# Altium project HVBoard.PrjPcb (part 2 of 2)

## Sheet ConnectorsAndProtection.SchDoc
size A4
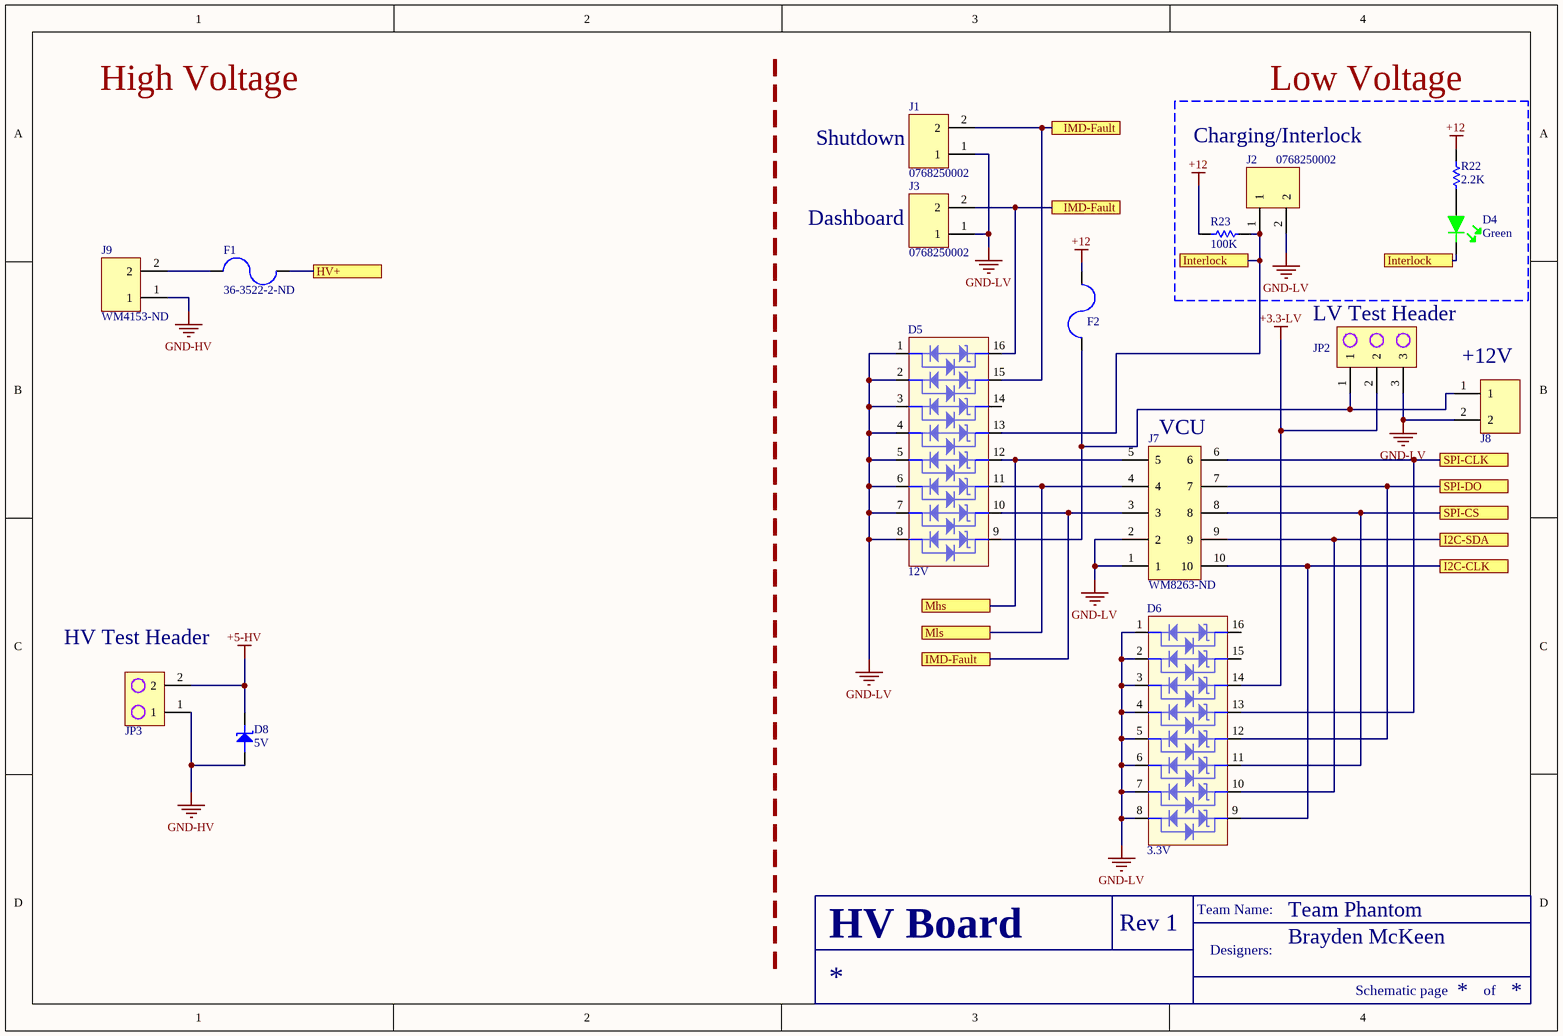
[diagram p3: ConnectorsAndProtection.SchDoc]

### Parts
D4  Green  [LED-0603]
D5  12V  [16-SO]
D6  3.3V  [16-SO]
D8  5V  [DIODE-SOD323]
F1  36-3522-2-ND  [Fuse Holder - 500V - 20A]
F2  36-3555-2-ND  [Fuse Holder - 500V - 50A]  (value not drawn)
J1  0768250002  [2X1PIN]
J2  0768250002  [2X1PIN]
J3  0768250002  [2X1PIN]
J7  WM8263-ND  [2X5PIN]
J8  952-2900-ND  [2Pin-POWER]  (value not drawn)
J9  WM4153-ND  [2PIN]
JP2  732-5316-ND  [3PIN-JP]  (value not drawn)
JP3  732-5315-ND  [2PIN-JP]  (value not drawn)
R22  2.2K  [RES-0805]
R23  100K  [RES-0805]

### Blocks framed on the sheet
Charging/Interlock: D4 J2 R22 R23

### Ports
HV+, I2C-CLK, I2C-SDA, IMD-Fault, Interlock, Mhs, Mls, SPI-CLK, SPI-CS, SPI-DO

### Nets
+3.3-LV: D6.14 JP2.2
+5-HV: D8.1 JP3.2
+12: F2.2 R22.1 R23.1
GND-HV: D8.2 J9.1 JP3.1
GND-LV: D5.1 D5.2 D5.3 D5.4 D5.5 D5.6 D5.7 D5.8 D6.1 D6.2 D6.3 D6.4 D6.5 D6.6 D6.7 D6.8 J1.1 J2.2 J3.1 J7.1 J7.2 J8.2 JP2.3
NetC1_2: F1.2 ; port HV+
NetD4_1: D4.1 R22.2
NetD4_2: D4.2 D5.13 J2.1 R23.2 ; port Interlock
NetD5_9: D5.9 F2.1 J8.1 JP2.1
NetD5_10: D5.10 D5.15 D5.16 J1.2 J3.2 J7.3 ; port IMD-Fault
NetD5_11: D5.11 J7.4 ; port Mls
NetD5_12: D5.12 J7.5 ; port Mhs
NetD6_9: D6.9 J7.10 ; port I2C-CLK
NetD6_10: D6.10 J7.9 ; port I2C-SDA
NetD6_11: D6.11 J7.8 ; port SPI-CS
NetD6_12: D6.12 J7.7 ; port SPI-DO
NetD6_13: D6.13 J7.6 ; port SPI-CLK
NetF1_1: F1.1 J9.2

Not connected (* = marked no-connect by the designer): D5 14; D6 15 16

### Notes on the sheet
- Shutdown
- (near J3) Dashboard
- LV Test Header
- (near J8) +12V
- (near J7) VCU
- (near JP3) HV Test Header
- High Voltage
- Low Voltage
- Team Name:
- Designers:
- Schematic page
- of

### Library data of the parts
D4 = LED-Green: LED GREEN CLEAR 0603 SMD; Manufacturer: Wurth Electronics; Manufacturer Part Number: 150060VS75000; Luminous Intensity: 40mcd; Viewing Angle: 140°; Forward Voltage: 2V; Wavelength: 570nm; Lens Style: Clear,Rectangular; Forward Current: 30mA; Test Current: 20mA; Supplier 1: Digi-Key; Stock 1: 118118; Pricing 1: 1=0.14, 50=0.133, 100=0.114, 500=0.099 (USD); Mount: Surface Mount; Case/Package: 0603; Number of Pins: 2; Color: Green; Case Code (Metric): 1608; Case Code (Imperial): 0603; Min Operating Temperature: -40°C; Max Operating Temperature: 85°C; Package Quantity: 1; Packaging: Tape and Reel; Dominant Wavelength: 570nm; Length: 1.6mm; Height: 0.7mm; Width: 0.8mm; REACH SVHC: Unknown; ComponentLink1URL: https://katalog.we-online.de/led/datasheet/150060VS75000.pdf?src-supplier=Digi-Key; ComponentLink1Description: https://katalog.we-online.de/led/datasheet/150060VS75000.pdf?src-supplier=Digi-Key; Supplier Part Number 1: 732-4980-1-ND
D5 = TVS-12V-X8: PD 300W VWM 12VCJ 25PFPACKAGE SO; Supplier 1: Digi-Key; Supplier Part Number 1: 1655-2159-1-ND
D6 = TVS-3.3V-X8: PD 300W VWM 3.3VCJ 25PFPACKAGE S; Supplier 1: Digi-Key; Supplier Part Number 1: 1655-2157-1-ND
D8 = TVS-5V: TVS DIODE 5V SOD323; Manufacturer: Nexperia; Manufacturer Part Number: PESD5V0U1UA,115; Supplier 1: Digi-Key; Stock 1: 127058; Pricing 1: 1=0.43, 10=0.32, 25=0.28, 100=0.152, 250=0.1512, 500=0.124, 1000=0.092 (USD); ComponentLink1URL: https://assets.nexperia.com/documents/data-sheet/PESD5V0U1UA_UB_UL.pdf?src-supplier=Digi-Key; ComponentLink1Description: https://assets.nexperia.com/documents/data-sheet/PESD5V0U1UA_UB_UL.pdf?src-supplier=Digi-Key; ComponentLink2URL: http://www.farnell.com/datasheets/453996.pdf?src-supplier=Farnell; ComponentLink2Description: http://www.farnell.com/datasheets/453996.pdf?src-supplier=Farnell; Supplier Part Number 1: 1727-4155-6-ND
F1 = Fuse Holder - 500V - 20A: FUSE CLIP BLADE 500V 20A PCB; Supplier 1: Digi-Key
F2 = Fuse Holder - 500V - 50A: FUSE BLOCK BLADE 500V 50A PCB; Supplier 1: Digi-Key
J1-J3 = 2X1PIN: CONN HEADER R/A 2POS; Manufacturer: Molex; Manufacturer Part Number: 76825-0002; Number of Circuits: 2; Gender: Male; Pitch: 5.7mm; Supplier 1: Digi-Key; Stock 1: 0; Pricing 1: 1=1.13, 10=0.993, 25=0.9344, 50=0.8956, 100=0.8567, 250=0.7788, 500=0.70092, 1000=0.62304, 2500=0.56463 (USD); Color: Black; Contact Plating: Tin; Contact Material: Copper; Termination: Through Hole; Number of Rows: 2; Orientation: Right Angle; Number of Contacts: 2; REACH SVHC: Unknown; ComponentLink1URL: http://www.farnell.com/datasheets/1968956.pdf?src-supplier=Element14; ComponentLink1Description: http://www.farnell.com/datasheets/1968956.pdf?src-supplier=Element14; ComponentLink2URL: http://www.farnell.com/datasheets/2216551.pdf?src-supplier=Newark; ComponentLink2Description: http://www.farnell.com/datasheets/2216551.pdf?src-supplier=Newark; ComponentLink3URL: http://www.farnell.com/datasheets/2216551.pdf?src-supplier=Farnell; ComponentLink3Description: http://www.farnell.com/datasheets/2216551.pdf?src-supplier=Farnell; ComponentLink4URL: https://www.molex.com/pdm_docs/sd/768250002_sd.pdf?src-supplier=Digi-Key; ComponentLink4Description: https://www.molex.com/pdm_docs/sd/768250002_sd.pdf?src-supplier=Digi-Key; ComponentLink5URL: http://www.farnell.com/datasheets/2001779.pdf?src-supplier=Element14; ComponentLink5Description: http://www.farnell.com/datasheets/2001779.pdf?src-supplier=Element14; ComponentLink6URL: http://www.alliedelec.com/images/products/datasheets/bm/BrandonData/70717238.pdf?src-supplier=Allied+Electronics; ComponentLink6Description: http://www.alliedelec.com/images/products/datasheets/bm/BrandonData/70717238.pdf?src-supplier=Allied+Electronics; Supplier Part Number 1: WM11969-ND
J7 = 2X5PIN: CONN HEADER R/A 10POS 2.54MM; Manufacturer: Molex; Manufacturer Part Number: 90130-3110; Number of Positions: 10; Connector Type: Male Pin; Max Voltage Rating (DC): 350.35kV; Max Voltage Rating (AC): 350V; Gender: Male; Current Rating: 3A; Row Spacing: 0.1inch; Glow Wire Compliant: Non-compliant; Supplier 1: Digi-Key; Stock 1: 3596; Pricing 1: 1=1.47, 10=1.329, 100=1.1395, 500=0.94956, 1000=0.8139, 5000=0.72166, 10000=0.70538 (USD); Mount: Through Hole; Color: Black; Housing Color: Black; Housing Material: Polyester; Contact Material: Brass; Contact Plating: Tin,Lead; Min Operating Temperature: -55°C; Max Operating Temperature: 125°C; Number of Rows: 2; Packaging: Tray; Termination: Solder; Orientation: Right Angle; Number of Contacts: 10; Package Quantity: 1; Voltage Rating: 350V; Number of Circuits: 10; Voltage Rating (DC): 350V; Length: 15.42mm; Pitch: 2.54mm; Depth: 9.75mm; Contact Mating Length: 0.266inch; Radiation Hardening: No; Flammability Rating: UL94 V-0; REACH SVHC: No SVHC; Lead Free: Lead Free; ComponentLink1URL: http://www.mouser.com/ds/2/276/0901303110_PCB_HEADERS-151522.pdf?src-supplier=Mouser; ComponentLink1Description: http://www.mouser.com/ds/2/276/0901303110_PCB_HEADERS-151522.pdf?src-supplier=Mouser; ComponentLink2URL: http://uk.rs-online.com/webdocs/13c4/0900766b813c4c8e.pdf?src-supplier=RSComponents; ComponentLink2Description: http://uk.rs-online.com/webdocs/13c4/0900766b813c4c8e.pdf?src-supplier=RSComponents; ComponentLink3URL: http://www.molex.com/webdocs/datasheets/pdf/en-us/0901303110_PCB_HEADERS.pdf?src-supplier=Avnet; ComponentLink3Description: http://www.molex.com/webdocs/datasheets/pdf/en-us/0901303110_PCB_HEADERS.pdf?src-supplier=Avnet; ComponentLink4URL: http://www.molex.com/pdm_docs/sd/901303110_sd.pdf?src-supplier=Digi-Key; ComponentLink4Description: http://www.molex.com/pdm_docs/sd/901303110_sd.pdf?src-supplier=Digi-Key; ComponentLink5URL: http://www.molex.com/webdocs/datasheets/pdf/en-us/0901303110_PCB_HEADERS.pdf?src-supplier=Avnet+Europe; ComponentLink5Description: http://www.molex.com/webdocs/datasheets/pdf/en-us/0901303110_PCB_HEADERS.pdf?src-supplier=Avnet+Europe; Supplier Part Number 1: WM8263-ND
J8 = 2PIN-POWER: CONN HEADER VERT 2POS 4MM 800V 40A; Supplier 1: Digi-Key; Supplier Part Number 1: 952-2900-ND
J9 = 2PIN: CONN HEADER R/A 2POS 2.54MM; Manufacturer: Molex; Manufacturer Part Number: 0705530106; Number of Positions: 2; Contact Resistance: 30mR; Connector Type: Male Pin; Supplier 1: Digi-Key; Stock 1: 2224; Pricing 1: 1=1.38, 10=1.25, 100=1.071, 500=0.8925, 1000=0.765, 5000=0.6783, 10000=0.663 (USD); Mount: Through Hole; Housing Material: Polyester; Contact Plating: Gold; Contact Material: Bronze; Color: Black; Housing Color: Black; Min Operating Temperature: -40°C; Max Operating Temperature: 105°C; Number of Rows: 1; Packaging: Rail/Tube; Termination: Solder; Number of Contacts: 2; Orientation: Right Angle; Length: 7.37mm; Pitch: 2.54mm; Depth: 13.59mm; Contact Mating Length: 0.24inch; ComponentLink1URL: http://www.molex.com/webdocs/datasheets/pdf/en-us/0705530106_PCB_HEADERS.pdf?src-supplier=Avnet+Asia; ComponentLink1Description: http://www.molex.com/webdocs/datasheets/pdf/en-us/0705530106_PCB_HEADERS.pdf?src-supplier=Avnet+Asia; ComponentLink2URL: https://www.molex.com/pdm_docs/ps/PS-70400.pdf?src-supplier=Digi-Key; ComponentLink2Description: https://www.molex.com/pdm_docs/ps/PS-70400.pdf?src-supplier=Digi-Key; Supplier Part Number 1: WM4153-ND
JP2 = 3PIN-TEST: CONN HEADER VERT 3POS 2.54MM
JP3 = 2PIN-TEST: CONN HEADER VERT 2POS 2.54MM
R22 = 0805-2.2KR: RES SMD 2.2K OHM 1% 1/8W 0805; Manufacturer: Yageo; Manufacturer Part Number: RC0805FR-072K2L; Power Rating: 125mW; Resistance: 2.2kR; Temperature Coefficient: 100ppm/°C; Voltage Rating: 150V; Supplier 1: Digi-Key; Stock 1: 4156138; Pricing 1: 1=0.1, 10=0.04, 100=0.0163, 1000=0.00731, 2500=0.00635 (USD); Case/Package: 0805; Number of Pins: 2; Case Code (Imperial): 0805; Case Code (Metric): 2012; Min Operating Temperature: -55°C; Max Operating Temperature: 155°C; Tolerance: 1%; Packaging: Tape and Reel; Voltage Rating (DC): 150V; Package Quantity: 1; Termination: SMD/SMT; Composition: Thick Film; Number of Terminations: 2; Max Power Dissipation: 125mW; Features: Moisture Resistant; Military Standard: Not; Length: 2mm; Height: 0.5mm; Width: 1.25mm; Depth: 1.25mm; Lead Pitch: 0.4mm; REACH SVHC: Unknown; Lead Free: Lead Free; ComponentLink1URL: http://www.farnell.com/datasheets/38627.pdf?src-supplier=Element14; ComponentLink1Description: http://www.farnell.com/datasheets/38627.pdf?src-supplier=Element14; ComponentLink2URL: http://www.farnell.com/datasheets/444164.pdf?src-supplier=Element14; ComponentLink2Description: http://www.farnell.com/datasheets/444164.pdf?src-supplier=Element14; ComponentLink3URL: http://www.yageo.com/documents/recent/PYu-RC_Group_51_RoHS_L_9.pdf?src-supplier=Digi-Key; ComponentLink3Description: http://www.yageo.com/documents/recent/PYu-RC_Group_51_RoHS_L_9.pdf?src-supplier=Digi-Key; ComponentLink4URL: http://www.yageo.com/documents/recent/PYu-RC_Group_51_RoHS_L_10.pdf?src-supplier=Digi-Key; ComponentLink4Description: http://www.yageo.com/documents/recent/PYu-RC_Group_51_RoHS_L_10.pdf?src-supplier=Digi-Key; Supplier Part Number 1: 311-2.20KCRDKR-ND
R23 = 0805-100KR: RES SMD 100K OHM 1% 1/8W 0805; Manufacturer: Yageo; Manufacturer Part Number: RC0805FR-07100KL; Resistance: 100kR; Temperature Coefficient: 100ppm/°C; Voltage Rating (DC): 150V; Power Rating: 125mW; Supplier 1: Digi-Key; Stock 1: 5636840; Pricing 1: 1=0.1, 10=0.04, 100=0.0163, 1000=0.00731, 2500=0.00635 (USD); Case/Package: 0805; Number of Pins: 2; Case Code (Metric): 2012; Case Code (Imperial): 0805; Min Operating Temperature: -55°C; Max Operating Temperature: 155°C; Tolerance: 1%; Packaging: Tape and Reel; Composition: Thick Film; Voltage Rating: 150V; Package Quantity: 1; Number of Terminations: 2; Termination: SMD/SMT; Military Standard: Not; Max Power Dissipation: 125mW; Features: Moisture Resistant; Length: 2mm; Height: 0.024inch; Width: 0.049inch; Depth: 1.25mm; Lead Pitch: 0.4mm; REACH SVHC: Unknown; Lead Free: Lead Free; ComponentLink1URL: http://www.yageo.com/documents/recent/PYu-RC_Group_51_RoHS_L_10.pdf?src-supplier=Digi-Key; ComponentLink1Description: http://www.yageo.com/documents/recent/PYu-RC_Group_51_RoHS_L_10.pdf?src-supplier=Digi-Key; ComponentLink2URL: http://www.yageo.com/documents/recent/PYu-RC_Group_51_RoHS_L_9.pdf?src-supplier=Mouser; ComponentLink2Description: http://www.yageo.com/documents/recent/PYu-RC_Group_51_RoHS_L_9.pdf?src-supplier=Mouser; ComponentLink3URL: http://documents.rs-components.com/techlib://itc_doclist_GB.htm?stockno=6185113&src-supplier=RSComponents; ComponentLink3Description: http://documents.rs-components.com/techlib://itc_doclist_GB.htm?stockno=6185113&src-supplier=RSComponents; ComponentLink4URL: http://www.yageo.ru/pdf/RC0805.pdf?src-supplier=Future+Electronics; ComponentLink4Description: http://www.yageo.ru/pdf/RC0805.pdf?src-supplier=Future+Electronics; ComponentLink5URL: http://www.farnell.com/datasheets/38627.pdf?src-supplier=Element14; ComponentLink5Description: http://www.farnell.com/datasheets/38627.pdf?src-supplier=Element14; ComponentLink6URL: http://www.farnell.com/datasheets/2167052.pdf?src-supplier=Element14; ComponentLink6Description: http://www.farnell.com/datasheets/2167052.pdf?src-supplier=Element14; ComponentLink7URL: http://www.farnell.com/datasheets/1686128.pdf?src-supplier=Element14; ComponentLink7Description: http://www.farnell.com/datasheets/1686128.pdf?src-supplier=Element14; ComponentLink8URL: http://www.farnell.com/datasheets/444164.pdf?src-supplier=Element14; ComponentLink8Description: http://www.farnell.com/datasheets/444164.pdf?src-supplier=Element14; Supplier Part Number 1: 311-100KCRDKR-ND

## Sheet HVPowerSupply.SchDoc
size A4
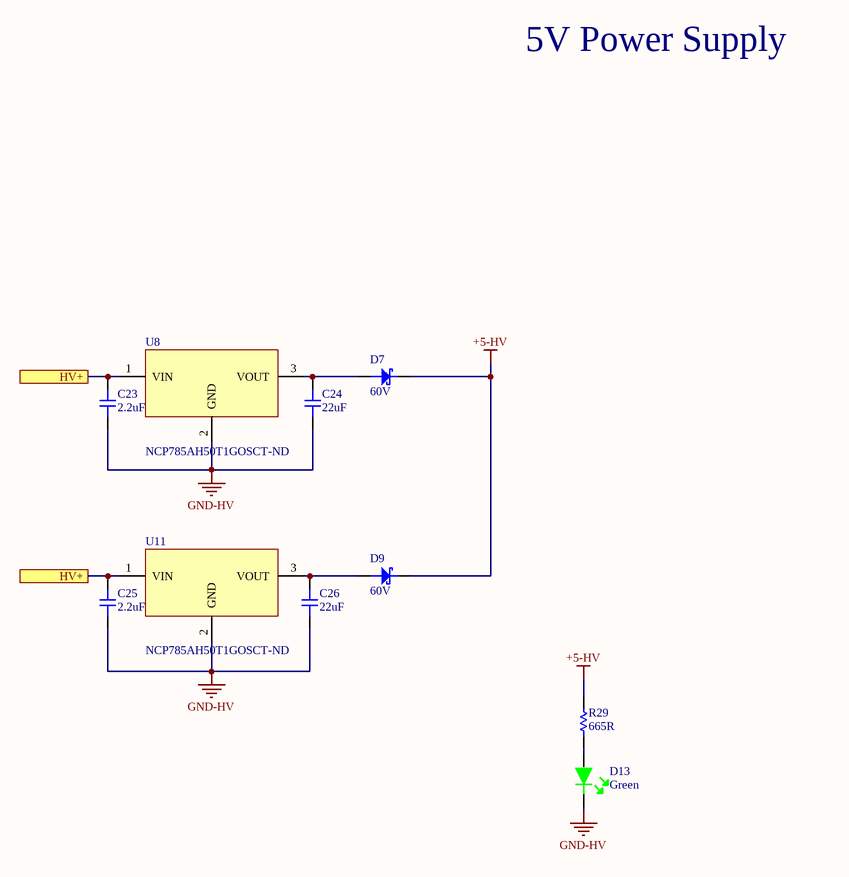
[diagram p4: HVPowerSupply.SchDoc]

### Parts
C23  2.2uF  [CAP-2220]
C24  22uF  [CAP-0805]
C25  2.2uF  [CAP-2220]
C26  22uF  [CAP-0805]
D7  60V  [Diode-SOD123W]
D9  60V  [Diode-SOD123W]
D13  Green  [LED-0603]
R29  665R  [RES-0805]
U8  NCP785AH50T1GOSCT-ND  [SOT-89]
U11  NCP785AH50T1GOSCT-ND  [SOT-89]

### Ports
HV+

### Nets
+5-HV: D7.1 D9.1 R29.2
GND-HV: C23.1 C24.1 C25.1 C26.1 D13.2 U8.2(GND) U11.2(GND)
NetC1_2: C23.2 C25.2 U8.1(VIN) U11.1(VIN) ; port HV+
NetC24_2: C24.2 D7.2 U8.3(VOUT)
NetC26_2: C26.2 D9.2 U11.3(VOUT)
NetD13_1: D13.1 R29.1

### Notes on the sheet
- 5V Power Supply
- High Voltage
- Low Voltage
- Team Name:
- Designers:
- Schematic page
- of

### Library data of the parts
C23 C25 = 2220-2.2uF-450V: CAP CER 2.2UF 450V X6S 2220; Manufacturer: TDK; Manufacturer Part Number: C5750X6S2W225K250KA; Tolerance: 10%; Supplier 1: Digi-Key; Stock 1: 8149; Pricing 1: 1=3.66, 10=2.957, 100=2.258 (USD); Mount: Surface Mount; Case/Package: 2220; Weight: 0.016932oz; Case Code (Metric): 5750; Case Code (Imperial): 2220; Min Operating Temperature: -55°C; Max Operating Temperature: 105°C; Package Quantity: 1; Capacitance: 2.2uF; Voltage Rating: 450V; Packaging: Tape and Reel; Dielectric: X6S; Termination: SMD/SMT; Voltage Rating (DC): 450V; Length: 5.7mm; Height: 2.5mm; Width: 0.197inch; Thickness: 0.11inch; Depth: 5mm; Radiation Hardening: No; REACH SVHC: No SVHC; Lead Free: Lead Free; ComponentLink1URL: http://product.tdk.com/capacitor/mlcc/en/documents/mlcc_commercial_midvoltage_en.pdf?src-supplier=Avnet+Europe; ComponentLink1Description: http://product.tdk.com/capacitor/mlcc/en/documents/mlcc_commercial_midvoltage_en.pdf?src-supplier=Avnet+Europe; Supplier Part Number 1: 445-7781-6-ND
C24 C26 = 0805-22uF-10V: CAP CER 22UF 10V X5R 0805; Manufacturer: KEMET; Manufacturer Part Number: C0805C226M8PACTU; Dielectric Material: Ceramic; Dissipation Factor: 10%; Tolerance: 20%; Supplier 1: Digi-Key; Stock 1: 29030; Pricing 1: 1=0.47, 10=0.331, 100=0.2179, 500=0.16142, 1000=0.1372 (USD); Mount: Surface Mount; Case/Package: 0805; Case Code (Metric): 2012; Case Code (Imperial): 0805; Min Operating Temperature: -55°C; Max Operating Temperature: 85°C; Packaging: Tape and Reel; Capacitance: 22uF; Voltage Rating: 10V; Voltage: 10V; Dielectric: X5R; Termination: Solder; Voltage Rating (DC): 10V; Length: 0.079inch; Height: 1.25mm; Width: 0.049inch; Thickness: 0.055inch; Depth: 1.25mm; Lead Free: Lead Free; ComponentLink1URL: http://www.farnell.com/datasheets/2746360.pdf?src-supplier=Newark; ComponentLink1Description: http://www.farnell.com/datasheets/2746360.pdf?src-supplier=Newark; ComponentLink2URL: http://www.farnell.com/datasheets/2746360.pdf?src-supplier=Farnell; ComponentLink2Description: http://www.farnell.com/datasheets/2746360.pdf?src-supplier=Farnell; ComponentLink3URL: http://www.farnell.com/datasheets/2746360.pdf?src-supplier=Element14; ComponentLink3Description: http://www.farnell.com/datasheets/2746360.pdf?src-supplier=Element14; ComponentLink4URL: https://api.kemet.com/component-edge/download/datasheet/C0805C226M8PAC7800.pdf?src-supplier=Digi-Key; ComponentLink4Description: https://api.kemet.com/component-edge/download/datasheet/C0805C226M8PAC7800.pdf?src-supplier=Digi-Key; ComponentLink5URL: http://www.alliedelec.com/m/d/f3c02ddb98afa3dd1adcb801109671e9.pdf?src-supplier=Allied+Electronics; ComponentLink5Description: http://www.alliedelec.com/m/d/f3c02ddb98afa3dd1adcb801109671e9.pdf?src-supplier=Allied+Electronics; Supplier Part Number 1: 399-12069-6-ND
D7 D9 = Schottky-60V-2A: DIODE SCHOTTKY 60V 2A SOD123W; Manufacturer: Nexperia; Manufacturer Part Number: PMEG6020ER,115; Supplier 1: Digi-Key; Stock 1: 416751; Pricing 1: 1=0.35, 10=0.287, 25=0.2624, 100=0.1647, 250=0.16288, 500=0.1525, 1000=0.1037 (USD); ComponentLink1URL: http://www.farnell.com/datasheets/609333.pdf?src-supplier=Newark; ComponentLink1Description: http://www.farnell.com/datasheets/609333.pdf?src-supplier=Newark; ComponentLink2URL: http://www.farnell.com/datasheets/609333.pdf?src-supplier=Farnell; ComponentLink2Description: http://www.farnell.com/datasheets/609333.pdf?src-supplier=Farnell; ComponentLink3URL: https://assets.nexperia.com/documents/data-sheet/PMEG6020ER.pdf?src-supplier=Digi-Key; ComponentLink3Description: https://assets.nexperia.com/documents/data-sheet/PMEG6020ER.pdf?src-supplier=Digi-Key; Supplier Part Number 1: 1727-5217-6-ND
D13 = LED-Green: as D4 on sheet ConnectorsAndProtection; Supplier 1: Digi-Key; Stock 1: 118118; Pricing 1: 1=0.14, 50=0.133, 100=0.114, 500=0.099 (USD); Mount: Surface Mount; Case/Package: 0603; Number of Pins: 2; Color: Green; Case Code (Metric): 1608; Case Code (Imperial): 0603; Min Operating Temperature: -40°C; Max Operating Temperature: 85°C; Package Quantity: 1; Packaging: Tape and Reel; Dominant Wavelength: 570nm; Length: 1.6mm; Height: 0.7mm; Width: 0.8mm; REACH SVHC: Unknown; ComponentLink1URL: https://katalog.we-online.de/led/datasheet/150060VS75000.pdf?src-supplier=Digi-Key; ComponentLink1Description: https://katalog.we-online.de/led/datasheet/150060VS75000.pdf?src-supplier=Digi-Key; Supplier Part Number 1: 732-4980-1-ND
R29 = 0805-665R: RES SMD 665 OHM 1% 1/8W 0805; Manufacturer: Panasonic; Manufacturer Part Number: ERJ-6ENF6650V; Power Rating: 125mW; Voltage Rating: 150V; Temperature Coefficient: 100ppm/°C; Supplier 1: Digi-Key; Stock 1: 180910; Pricing 1: 1=0.1, 10=0.078, 100=0.0301, 1000=0.01324, 2500=0.01144 (USD); Mount: Surface Mount; Case/Package: 0805; Case Code (Metric): 2012; Case Code (Imperial): 0805; Contact Plating: Tin; Min Operating Temperature: -55°C; Max Operating Temperature: 155°C; Resistance: 665R; Packaging: Tape and Reel; Tolerance: 1%; Package Quantity: 1; Composition: Thick Film; Number of Terminations: 2; Termination: SMD/SMT; Military Standard: Not; Max Power Dissipation: 125mW; Voltage Rating (DC): 150V; Features: Automotive AEC-Q200; Length: 2mm; Height: 0.6mm; Width: 0.049inch; Depth: 1.25mm; Height - Seated (Max): 0.028inch; REACH SVHC: Unknown; Lead Free: Lead Free; ComponentLink1URL: http://www.farnell.com/datasheets/1678782.pdf?src-supplier=Element14; ComponentLink1Description: http://www.farnell.com/datasheets/1678782.pdf?src-supplier=Element14; ComponentLink2URL: http://www.mouser.com/ds/2/315/AOA0000CE2-37512.pdf?src-supplier=Mouser; ComponentLink2Description: http://www.mouser.com/ds/2/315/AOA0000CE2-37512.pdf?src-supplier=Mouser; ComponentLink3URL: https://www.alliedelec.com/m/d/623f45ff1957d936ff56d46fd1c28cac.pdf?src-supplier=Allied+Electronics; ComponentLink3Description: https://www.alliedelec.com/m/d/623f45ff1957d936ff56d46fd1c28cac.pdf?src-supplier=Allied+Electronics; ComponentLink4URL: http://www.farnell.com/datasheets/1678782.pdf?src-supplier=Farnell; ComponentLink4Description: http://www.farnell.com/datasheets/1678782.pdf?src-supplier=Farnell; ComponentLink5URL: http://www.industrial.panasonic.com/www-data/pdf/AOA0000/AOA0000CE2.pdf?src-supplier=Element14; ComponentLink5Description: http://www.industrial.panasonic.com/www-data/pdf/AOA0000/AOA0000CE2.pdf?src-supplier=Element14; Supplier Part Number 1: P665CDKR-ND
U8 U11 = LDO-5V-10mA: IC REG LINEAR  5V 10MA SOT89-3; Manufacturer: ON Semiconductor; Output Voltage: 12V; Number of Regulators: 1; Min Current Limit: 10.5mA; Min Input Voltage (DC): 55V; Max Input Voltage (DC): 450V; Min Input Voltage: 85V; Polarity: Positive; Reference Voltage: 1.25V; Quiescent Current: 22uA; Accuracy: 5%; Output Type: Fixed; Supplier 1: Digi-Key; Manufacturer Part Number: NCP785AH50T1G; Stock 1: 2397; Pricing 1: 1=0.83, 10=0.738, 25=0.7, 100=0.5375, 250=0.475, 500=0.45, 1000=0.35 (USD); Mount: Surface Mount; Case/Package: SOT-89; Number of Pins: 3; Min Operating Temperature: -40°C; Max Operating Temperature: 85°C; Packaging: Cut Tape; Output Current: 10mA; Nominal Output Voltage: 12V; Max Input Voltage: 450V; Number of Outputs: 1; Length: 4.6mm; Height: 1.6mm; Width: 2.6mm; REACH SVHC: No SVHC; Lead Free: Lead Free; ComponentLink1URL: http://www.onsemi.com/pub/Collateral/NCP785A-D.PDF?src-supplier=Digi-Key; ComponentLink1Description: http://www.onsemi.com/pub/Collateral/NCP785A-D.PDF?src-supplier=Digi-Key; ComponentLink2URL: http://www.farnell.com/datasheets/1948370.pdf?src-supplier=Farnell; ComponentLink2Description: http://www.farnell.com/datasheets/1948370.pdf?src-supplier=Farnell; ComponentLink3URL: http://www.farnell.com/datasheets/1948370.pdf?src-supplier=Element14; ComponentLink3Description: http://www.farnell.com/datasheets/1948370.pdf?src-supplier=Element14; ComponentLink4URL: http://uk.rs-online.com/webdocs/141c/0900766b8141c022.pdf?src-supplier=RSComponents; ComponentLink4Description: http://uk.rs-online.com/webdocs/141c/0900766b8141c022.pdf?src-supplier=RSComponents; ComponentLink5URL: http://www.onsemi.com/pub/Collateral/NCP785A-D.PDF?src-supplier=Avnet; ComponentLink5Description: http://www.onsemi.com/pub/Collateral/NCP785A-D.PDF?src-supplier=Avnet; Supplier Part Number 1: NCP785AH120T1GOSDKR-ND

## Nets that join several sheets
+3.3-LV: VoltageMeasurement (8 pins), IsoPowerSupply (10 pins), ConnectorsAndProtection (D6.14 JP2.2)
+5-HV: VoltageMeasurement (6 pins), ConnectorsAndProtection (D8.1 JP3.2), HVPowerSupply (D7.1 D9.1 R29.2)
+12: IsoPowerSupply (8 pins), IMD (J6.7 R11.2), ConnectorsAndProtection (F2.2 R22.1 R23.1)
GND-HV: VoltageMeasurement (8 pins), IsoPowerSupply (7 pins), IMD (J4.1 J4.2), ConnectorsAndProtection (D8.2 J9.1 JP3.1), HVPowerSupply (7 pins)
GND-LV: VoltageMeasurement (13 pins), IsoPowerSupply (15 pins), IMD (6 pins), ConnectorsAndProtection (23 pins)
NetC1_2: VoltageMeasurement (R6.1), IsoPowerSupply (C1.2 C6.2 U3.1), IMD (J5.1 J5.2), ConnectorsAndProtection (F1.2), HVPowerSupply (C23.2 C25.2 U8.1 U11.1)
NetD4_2: IsoPowerSupply (Q1.1), ConnectorsAndProtection (D4.2 D5.13 J2.1 R23.2)
NetD5_10: IMD (J6.1 R13.2), ConnectorsAndProtection (6 pins)
NetD5_11: IMD (J6.3 R11.1), ConnectorsAndProtection (D5.11 J7.4)
NetD5_12: IMD (J6.4 R12.2), ConnectorsAndProtection (D5.12 J7.5)
NetD6_9: IsoPowerSupply (R4.1 U1.5), ConnectorsAndProtection (D6.9 J7.10)
NetD6_10: IsoPowerSupply (R3.1 U1.4), ConnectorsAndProtection (D6.10 J7.9)
NetD6_11: VoltageMeasurement (U7.4), ConnectorsAndProtection (D6.11 J7.8)
NetD6_12: VoltageMeasurement (U7.3), ConnectorsAndProtection (D6.12 J7.7)
NetD6_13: VoltageMeasurement (U7.2), ConnectorsAndProtection (D6.13 J7.6)